# Altium schematic sheet IMU.SchDoc
size A4; SheetNumber: 5; SheetTotal: 9
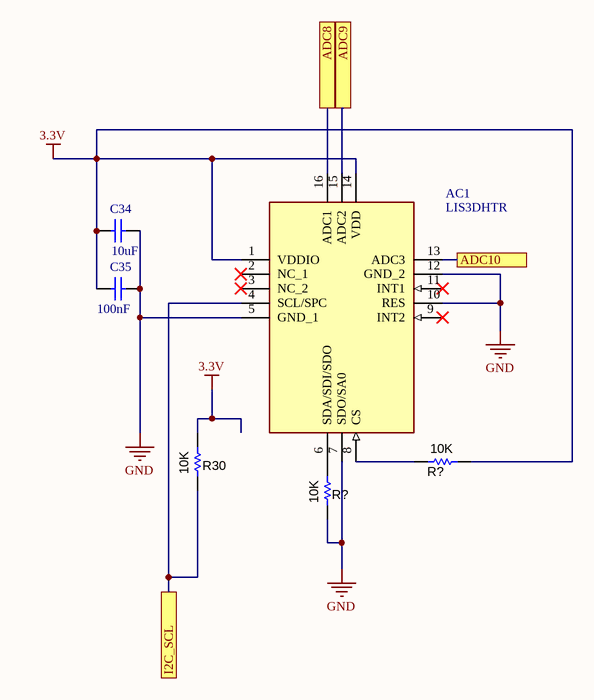
[diagram p0: IMU.SchDoc]

## Parts
(Parts that share a designator on the sheet are numbered #1, #2 ... from top to bottom, then left to right.)
AC1  LIS3DHTR  [LIS3DHTR]
C34  value 10uF  [C0805]  (hidden comment: Cap)
C35  value 100nF  [C0805]  (hidden comment: 10V)
R30  value 10K  [0603L]  (hidden comment: 4.7K)
R?#1  value 10K  [0603L]  (hidden comment: CRCW060356R0JNEA)
R?#2  value 10K  [0603L]  (hidden comment: CRCW060356R0JNEA)

## Ports
ADC8, ADC9, ADC10, I2C_SCL

## Nets
3.3V: AC1.1(VDDIO) AC1.14(VDD) C34.1 C35.1 R30.2 R?#1.2
GND: AC1.5(GND_1) AC1.7(SDO/SA0) AC1.10(RES) AC1.12(GND_2) C34.2 C35.2 R?#2.1
ADC8: AC1.16(ADC1) ; port ADC8
ADC9: AC1.15(ADC2) ; port ADC9
ADC10: AC1.13(ADC3) ; port ADC10
I2C_SCL: AC1.4(SCL/SPC) R30.1 ; port I2C_SCL
NetAC1_6: AC1.6(SDA/SDI/SDO) R?#2.2
NetAC1_8: AC1.8(CS) R?#1.1

Not connected (* = marked no-connect by the designer): AC1 2(NC_1)* 3(NC_2)* 9(INT2)* 11(INT1)*

## Notes on the sheet
- Title:
- Size:
- Date:
- A4
- Author:
- Revision:
- Sheet
- of
- File:

## Library data of the parts
AC1 = LIS3DHTR: Accelerometer; Manufacturer_Name: STMicroelectronics; Datasheet Link: http://www.st.com/content/ccc/resource/technical/document/datasheet/3c/ae/50/85/d6/b1/46/fe/CD00274221.pdf/files/CD00274221.pdf/jcr:content/translations/en.CD00274221.pdf; Height: 1mm; Manufacturer_Part_Number: LIS3DHTR; Mouser Part Number: 511-LIS3DHTR; Mouser Price/Stock: https://www.mouser.co.uk/ProductDetail/STMicroelectronics/LIS3DHTR/?qs=6la6oa3D8xzhXYax3cEo4w%3D%3D; Arrow Part Number: LIS3DHTR; Arrow Price/Stock: https://www.arrow.com/en/products/lis3dhtr/stmicroelectronics
C34 = Cap: Capacitor; Published: 8-Jun-2000; LatestRevisionDate: 17-Jul-2002; LatestRevisionNote: Re-released for DXP Platform.; PackageReference: RAD-0.3; Publisher: Altium Limited; PackageDescription: Radial Cap, Thru-Hole; 2 Leads; 0.3 in Pin Spacing
C35 = Cap: C0805C104K8RACTU. 0.1µF ±10% 10V Ceramic Capacitor X7R 0805 (2012 Metric) /; Published: 8-Jun-2000; LatestRevisionDate: 17-Jul-2002; LatestRevisionNote: Re-released for DXP Platform.; PackageReference: RAD-0.3; Publisher: Altium Limited; PackageDescription: Radial Cap, Thru-Hole; 2 Leads; 0.3 in Pin Spacing
R30 R?#1 R?#2 = CRCW060356R0JNEA: RES, 56 ohm, 5%, 0.1W, 0603; Manufacturer: Vishay-Dale; CompType: Resistor; Res_ohm: 56; Value_Code: 56R0; Tolerance_%: 5; Power_W: 0.1; VDC_V: 75; TempCo: 200 ppm/C; EIA_Code: E24; U/M: EA; SymbolVersion: 2009-05-29; PartNumber: CRCW060356R0JNEA; PackageReference: 0603; RoHS: Y; Value1: 5%; Value2: 0.1W; MountType: SMT; Technology: Thick Film; Published: 2008-06-26; Publisher: Texas Instruments; LatestRevisionDate: 2014-01-08; ComponentLink1Description: Datasheet link; ComponentLink1URL: http://www.vishay.com/docs/20035/dcrcwe3.pdf; Supplier 1: Digi-Key; Supplier Part Number 1: 541-56GCT-ND; Supplier 2: Mouser; Supplier Part Number 2: 71-CRCW0603J-56-E3; Supplier 3: Farnell; Supplier Part Number 3: 1514781